# EAGLE schematic SkyKontrol-smartDisplay (EAGLE 9.5.2)
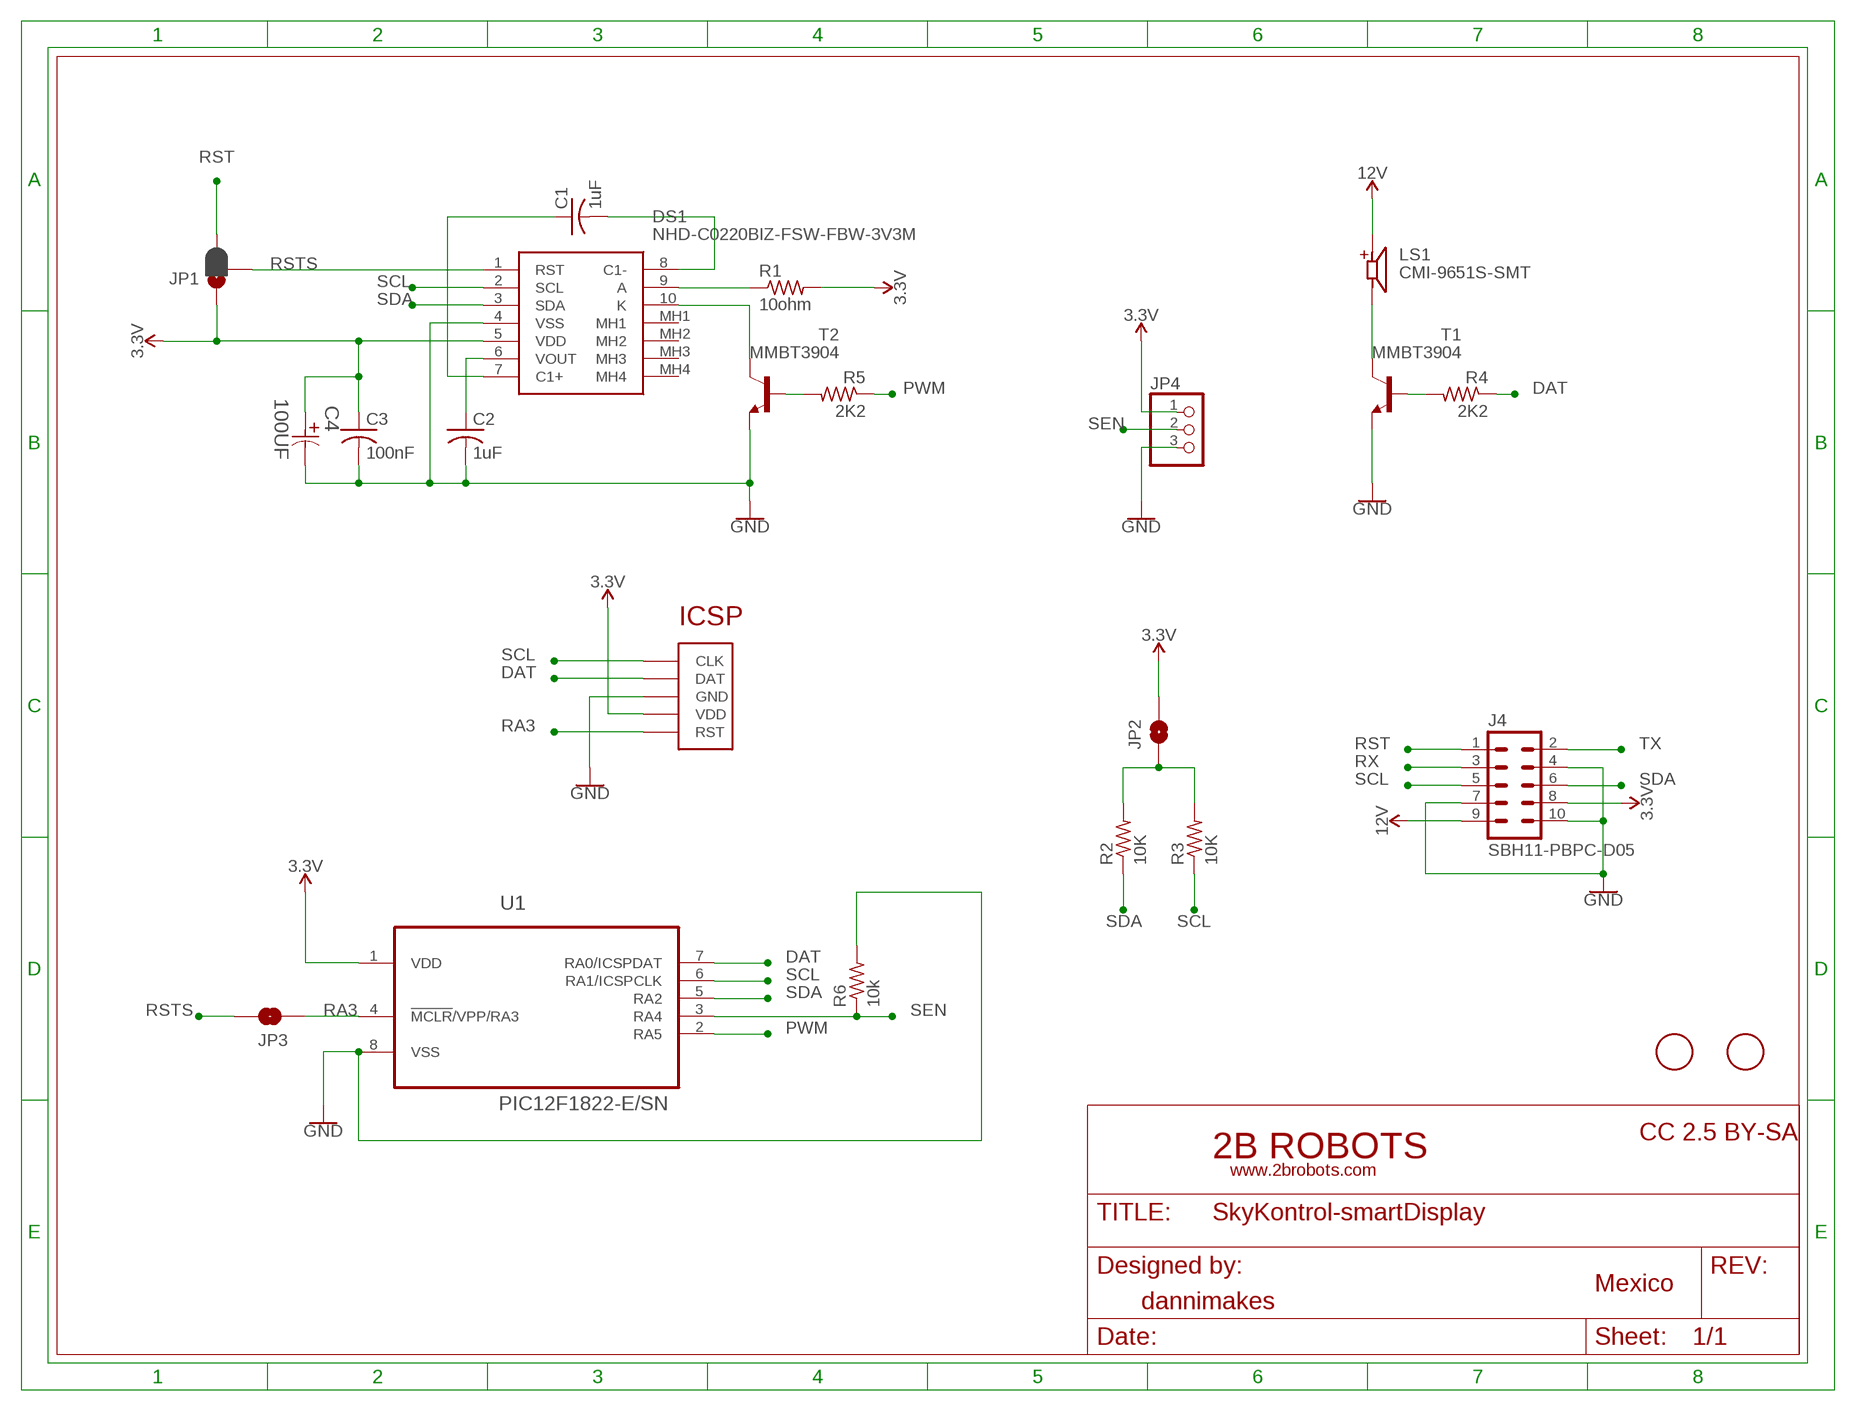
[diagram p0: schematic, sheet 1]

## Parts
C1  1uF  C-USC0603K  [C0603K]
C2  1uF  C-USC0603K  [C0603K]
C3  100nF  C-USC0603K  [C0603K]
C4  100UF  EEE-HA1E101XP-CASE-D8  [CAPAE660X800N]
DS1  NHD-C0220BIZ-FSW-FBW-3V3M  [NHDC0220BIZFSWFBW3V3M]
J4  SBH11-PBPC-D05  [SBH11-PBPC-D05]
JP1  JUMPER-SMT_3_1-NC_PASTE_SILK  [SMT-JUMPER_3_1-NC_PASTE_SILK]
JP2  JUMPER-SMT_2_NO_SILK  [SMT-JUMPER_2_NO_SILK]
JP3  JUMPER-SMT_2_NO_SILK  [SMT-JUMPER_2_NO_SILK]
JP4  PINHD-1X3CB  [1X03-CLEANBIG]
LS1  CMI-9651S-SMT  [CUI_CMI-9651S-SMT]
R1  10ohm  R-US_R0805  [R0805]
R2  10K  R-US_R0805  [R0805]
R3  10K  R-US_R0805  [R0805]
R4  2K2  R-US_R0805  [R0805]
R5  2K2  R-US_R0805  [R0805]
R6  10k  R-US_R0805  [R0805]
T1  MMBT3904  MMBT3904LT1-NPN-SOT23-BEC  [SOT23-BEC]
T2  MMBT3904  MMBT3904LT1-NPN-SOT23-BEC  [SOT23-BEC]
U1  PIC12F1822-E/SN  [SOIC127P600X175-8N]
U$1  FIDUCIAL  [FIDUCIAL_1MM]
U$2  ICSP_POGO  [ICSP_POGO]
U$3  FIDUCIAL  [FIDUCIAL_1MM]

## Nets
3.3V: C3.1 C4.1 DS1.5(VDD) J4.8 JP1.1 JP2.2 JP4.1 R1.2 U1.1(VDD) U$2.P$2(VDD)
12V: J4.9 LS1.P
DAT: R4.1 U1.7(RA0/ICSPDAT) U$2.P$4(DAT)
GND: C2.2 C3.2 C4.2 DS1.4(VSS) J4.4 J4.7 J4.10 JP4.3 R6.2 T1.E T2.E U1.8(VSS) U$2.P$3(GND)
N$1: C2.1 DS1.6(VOUT)
N$2: C1.2 DS1.8(C1-)
N$3: C1.1 DS1.7(C1+)
N$4: DS1.9(A) R1.1
N$8: JP2.1 R2.2 R3.2
N$10: LS1.N T1.C
N$12: R4.2 T1.B
N$17: DS1.10(K) T2.C
N$19: R5.2 T2.B
PWM: R5.1 U1.2(RA5)
RA3: JP3.1 U1.4(!MCLR!/VPP/RA3) U$2.P$1(RST)
RST: J4.1 JP1.3
RSTS: DS1.1(RST) JP1.2 JP3.2
RX: J4.3
SCL: DS1.2(SCL) J4.5 R3.1 U1.6(RA1/ICSPCLK) U$2.P$5(CLK)
SDA: DS1.3(SDA) J4.6 R2.1 U1.5(RA2)
SEN: JP4.2 R6.1 U1.3(RA4)
TX: J4.2
Unconnected: DS1.MH1 DS1.MH2 DS1.MH3 DS1.MH4

## Library data of the parts
C1-C3 = adafruit:C-US: CAPACITOR, American symbol
C4 = Panasonic-EEEFT_EEEH:EEE-: Aluminum Electrolytic Capacitors,Surface Mount Type; MPN: EEE-HA1E101XP; OC_FARNELL: 1973328; OC_NEWARK: 58T9236; PACKAGE: CASE-D8; SUPPLIER: PANASONIC; TOLERANCE: ±20 %; VOLTAGERATING: 25V
DS1 = NHD-C0220BIZ-FSW-FBW-3V3M:NHD-C0220BIZ-FSW-FBW-3V3M: LCD Character Display Modules & Accessories 2 x 20 FSTN (+) Transf White LED Source: Datasheet <https://componentsearchengine.com/Datasheets/1/NHD-C0220BiZ-FSW-FBW-3V3M.pdf>; DESCRIPTION: LCD Character Display Modules & Accessories 2 x 20 FSTN (+) Transf White LED; HEIGHT: 7mm; MANUFACTURER_NAME: Newhaven Display; MANUFACTURER_PART_NUMBER: NHD-C0220BIZ-FSW-FBW-3V3M; MOUSER_PART_NUMBER: 763-C0220BIZ-FSW-FBW; MOUSER_PRICE-STOCK: https://www.mouser.com/Search/Refine.aspx?Keyword=763-C0220BIZ-FSW-FBW
J4 = con-sullins:SBH11-PBPC-D05: HEADER - Vertical, Shrouded
JP1 = SparkFun-Jumpers:JUMPER-SMT_3_1-NC_PASTE: Normally closed solder jumper (1 of 2 connections) This jumper has an aperture in the stencil to allow solder paste to bridge one of the two connections. One connection is normally closed (NC), while the other is normally open (NO). Wick off the solder to open the connection. Reapply solder to reclose the connection. Apply solder to the other side instead to change the current path.
JP2 JP3 = SparkFun-Jumpers:JUMPER-SMT_2_NO: Normally open jumper This jumper has two pads in close proximity to each other. Apply solder to close the connection. Round pads are easier to solder for beginners, but are a lot larger. SparkFun Product that uses the round pads: SparkFun EL Sequencer <https://www.sparkfun.com/products/12781>
JP4 = adafruit:PINHD-1X3: PIN HEADER
LS1 = CMI-9651S-SMT:CMI-9651S-SMT: 9.6 mm, 12 Vdc, 90 dB, 2.7 kHz, Surface Mount (SMT), Driving Circuit, Magnetic Audio Indicator Buzzer; MANUFACTURER: CUI INC; PARTREV: 1.0; STANDARD: Manufacturer recommendations
R1-R6 = adafruit:R-US_: RESISTOR, American symbol
T1 T2 = transistor:*-NPN-: NPN Transistror BF959 corrected 2008.03.06
U1 = Microchip-PIC12F1822-E_SN:PIC12F1822-E/SN: 8/14-Pin Flash Microcontrollers,SOIC-8; MPN: PIC12F1822-E/SN; OC_FARNELL: 2315760; OC_NEWARK: 53R0195; PACKAGE: SOIC-8; SUPPLIER: Microchip
U$1 U$3 = adafruit:FIDUCIAL: For use by pick and place machines to calibrate the vision/machine, 1mm By microbuilder.eu
U$2 = ICSP_POGO:ICSP_POGO